# EAGLE schematic line-sensor-r2 (EAGLE 9.3.1)
Assembly variants: I2C, USART, SPI

## Sheet 1 of 4
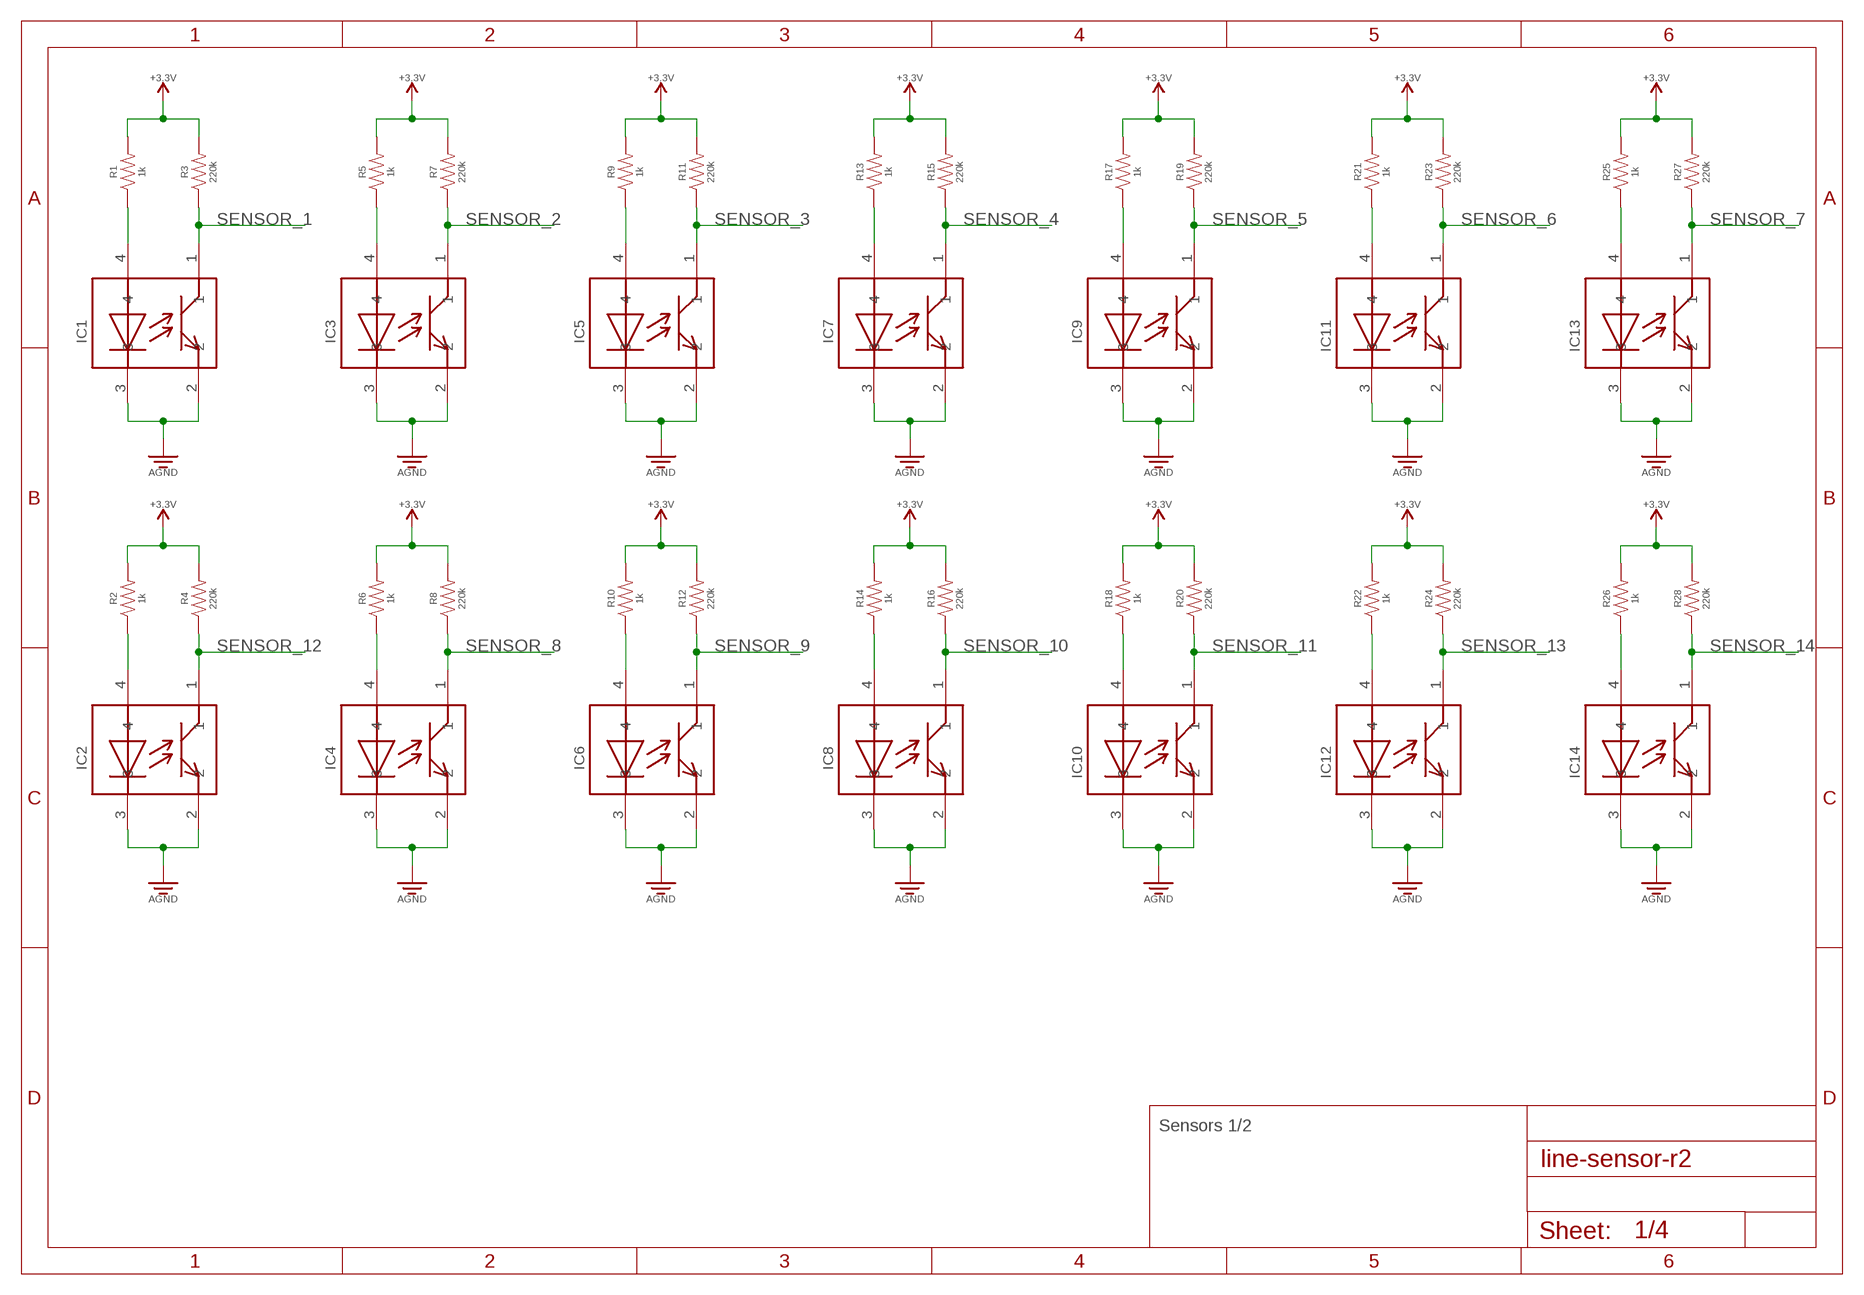
[diagram p0: schematic, sheet 1]

### Parts
IC1  GP2S60  [GP2S60]
IC2  GP2S60  [GP2S60]
IC3  GP2S60  [GP2S60]
IC4  GP2S60  [GP2S60]
IC5  GP2S60  [GP2S60]
IC6  GP2S60  [GP2S60]
IC7  GP2S60  [GP2S60]
IC8  GP2S60  [GP2S60]
IC9  GP2S60  [GP2S60]
IC10  GP2S60  [GP2S60]
IC11  GP2S60  [GP2S60]
IC12  GP2S60  [GP2S60]
IC13  GP2S60  [GP2S60]
IC14  GP2S60  [GP2S60]
R1  1k  RESISTOR_0.1W  [RESISTOR-0603]
R2  1k  RESISTOR_0.1W  [RESISTOR-0603]
R3  220k  RESISTOR_0.1W  [RESISTOR-0603]
R4  220k  RESISTOR_0.1W  [RESISTOR-0603]
R5  1k  RESISTOR_0.1W  [RESISTOR-0603]
R6  1k  RESISTOR_0.1W  [RESISTOR-0603]
R7  220k  RESISTOR_0.1W  [RESISTOR-0603]
R8  220k  RESISTOR_0.1W  [RESISTOR-0603]
R9  1k  RESISTOR_0.1W  [RESISTOR-0603]
R10  1k  RESISTOR_0.1W  [RESISTOR-0603]
R11  220k  RESISTOR_0.1W  [RESISTOR-0603]
R12  220k  RESISTOR_0.1W  [RESISTOR-0603]
R13  1k  RESISTOR_0.1W  [RESISTOR-0603]
R14  1k  RESISTOR_0.1W  [RESISTOR-0603]
R15  220k  RESISTOR_0.1W  [RESISTOR-0603]
R16  220k  RESISTOR_0.1W  [RESISTOR-0603]
R17  1k  RESISTOR_0.1W  [RESISTOR-0603]
R18  1k  RESISTOR_0.1W  [RESISTOR-0603]
R19  220k  RESISTOR_0.1W  [RESISTOR-0603]
R20  220k  RESISTOR_0.1W  [RESISTOR-0603]
R21  1k  RESISTOR_0.1W  [RESISTOR-0603]
R22  1k  RESISTOR_0.1W  [RESISTOR-0603]
R23  220k  RESISTOR_0.1W  [RESISTOR-0603]
R24  220k  RESISTOR_0.1W  [RESISTOR-0603]
R25  1k  RESISTOR_0.1W  [RESISTOR-0603]
R26  1k  RESISTOR_0.1W  [RESISTOR-0603]
R27  220k  RESISTOR_0.1W  [RESISTOR-0603]
R28  220k  RESISTOR_0.1W  [RESISTOR-0603]
SUPPLY1  +3.3V  (no package)
SUPPLY2  +3.3V  (no package)
SUPPLY3  +3.3V  (no package)
SUPPLY4  +3.3V  (no package)
SUPPLY5  +3.3V  (no package)
SUPPLY6  +3.3V  (no package)
SUPPLY7  +3.3V  (no package)
SUPPLY8  +3.3V  (no package)
SUPPLY9  +3.3V  (no package)
SUPPLY10  +3.3V  (no package)
SUPPLY11  +3.3V  (no package)
SUPPLY12  +3.3V  (no package)
SUPPLY13  +3.3V  (no package)
SUPPLY14  +3.3V  (no package)

### Nets
3V3 [3v3]: R1.P$2 R2.P$2 R3.P$2 R4.P$2 R5.P$2 R6.P$2 R7.P$2 R8.P$2 R9.P$2 R10.P$2 R11.P$2 R12.P$2 R13.P$2 R14.P$2 R15.P$2 R16.P$2 R17.P$2 R18.P$2 R19.P$2 R20.P$2 R21.P$2 R22.P$2 R23.P$2 R24.P$2 R25.P$2 R26.P$2 R27.P$2 R28.P$2 SUPPLY1.VCC SUPPLY2.VCC SUPPLY3.VCC SUPPLY4.VCC SUPPLY5.VCC SUPPLY6.VCC SUPPLY7.VCC SUPPLY8.VCC SUPPLY9.VCC SUPPLY10.VCC SUPPLY11.VCC SUPPLY12.VCC SUPPLY13.VCC SUPPLY14.VCC ; also sheet 2
GND: IC1.2 IC1.3 IC2.2 IC2.3 IC3.2 IC3.3 IC4.2 IC4.3 IC5.2 IC5.3 IC6.2 IC6.3 IC7.2 IC7.3 IC8.2 IC8.3 IC9.2 IC9.3 IC10.2 IC10.3 IC11.2 IC11.3 IC12.2 IC12.3 IC13.2 IC13.3 IC14.2 IC14.3 ; supply symbol labelled AGND ; also sheet 2,3,4
N$1: IC3.4 R5.P$1
N$2: IC1.4 R1.P$1
N$3: IC5.4 R9.P$1
N$4: IC7.4 R13.P$1
N$5: IC9.4 R17.P$1
N$6: IC11.4 R21.P$1
N$7: IC13.4 R25.P$1
N$8: IC4.4 R6.P$1
N$9: IC6.4 R10.P$1
N$10: IC8.4 R14.P$1
N$11: IC10.4 R18.P$1
N$12: IC2.4 R2.P$1
N$13: IC12.4 R22.P$1
N$14: IC14.4 R26.P$1
SENSOR_1: IC1.1 R3.P$1 ; also sheet 3
SENSOR_2: IC3.1 R7.P$1 ; also sheet 3
SENSOR_3: IC5.1 R11.P$1 ; also sheet 3
SENSOR_4: IC7.1 R15.P$1 ; also sheet 3
SENSOR_5: IC9.1 R19.P$1 ; also sheet 3
SENSOR_6: IC11.1 R23.P$1 ; also sheet 3
SENSOR_7: IC13.1 R27.P$1 ; also sheet 3
SENSOR_8: IC4.1 R8.P$1 ; also sheet 3
SENSOR_9: IC6.1 R12.P$1 ; also sheet 3
SENSOR_10: IC8.1 R16.P$1 ; also sheet 3
SENSOR_11: IC10.1 R20.P$1 ; also sheet 3
SENSOR_12: IC2.1 R4.P$1 ; also sheet 3
SENSOR_13: IC12.1 R24.P$1 ; also sheet 3
SENSOR_14: IC14.1 R28.P$1 ; also sheet 3

### Notes on the sheet
- Sensors 1/2

## Sheet 2 of 4
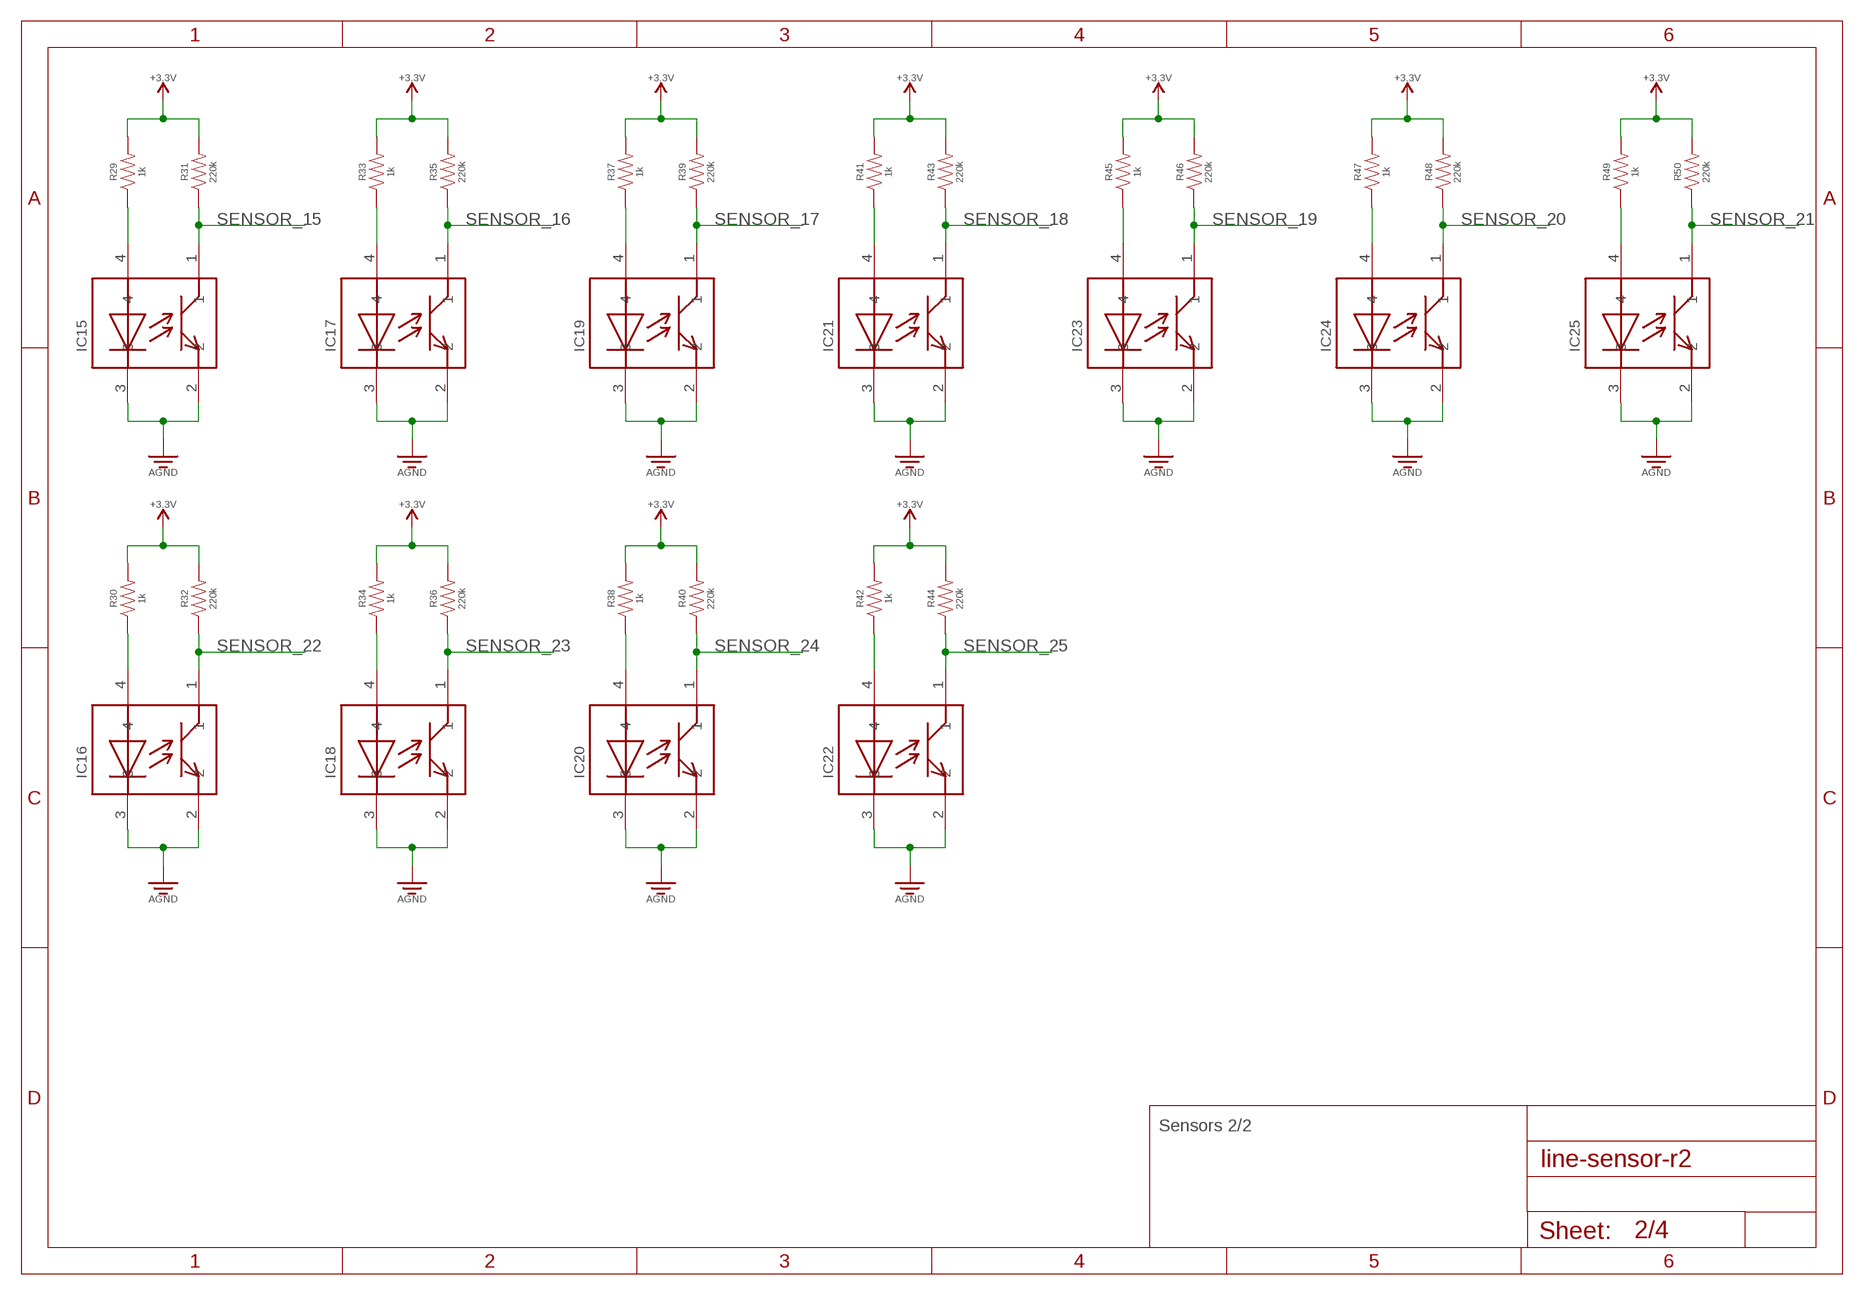
[diagram p1: schematic, sheet 2]

### Parts
IC15  GP2S60  [GP2S60]
IC16  GP2S60  [GP2S60]
IC17  GP2S60  [GP2S60]
IC18  GP2S60  [GP2S60]
IC19  GP2S60  [GP2S60]
IC20  GP2S60  [GP2S60]
IC21  GP2S60  [GP2S60]
IC22  GP2S60  [GP2S60]
IC23  GP2S60  [GP2S60]
IC24  GP2S60  [GP2S60]
IC25  GP2S60  [GP2S60]
R29  1k  RESISTOR_0.1W  [RESISTOR-0603]
R30  1k  RESISTOR_0.1W  [RESISTOR-0603]
R31  220k  RESISTOR_0.1W  [RESISTOR-0603]
R32  220k  RESISTOR_0.1W  [RESISTOR-0603]
R33  1k  RESISTOR_0.1W  [RESISTOR-0603]
R34  1k  RESISTOR_0.1W  [RESISTOR-0603]
R35  220k  RESISTOR_0.1W  [RESISTOR-0603]
R36  220k  RESISTOR_0.1W  [RESISTOR-0603]
R37  1k  RESISTOR_0.1W  [RESISTOR-0603]
R38  1k  RESISTOR_0.1W  [RESISTOR-0603]
R39  220k  RESISTOR_0.1W  [RESISTOR-0603]
R40  220k  RESISTOR_0.1W  [RESISTOR-0603]
R41  1k  RESISTOR_0.1W  [RESISTOR-0603]
R42  1k  RESISTOR_0.1W  [RESISTOR-0603]
R43  220k  RESISTOR_0.1W  [RESISTOR-0603]
R44  220k  RESISTOR_0.1W  [RESISTOR-0603]
R45  1k  RESISTOR_0.1W  [RESISTOR-0603]
R46  220k  RESISTOR_0.1W  [RESISTOR-0603]
R47  1k  RESISTOR_0.1W  [RESISTOR-0603]
R48  220k  RESISTOR_0.1W  [RESISTOR-0603]
R49  1k  RESISTOR_0.1W  [RESISTOR-0603]
R50  220k  RESISTOR_0.1W  [RESISTOR-0603]
SUPPLY15  +3.3V  (no package)
SUPPLY16  +3.3V  (no package)
SUPPLY17  +3.3V  (no package)
SUPPLY18  +3.3V  (no package)
SUPPLY19  +3.3V  (no package)
SUPPLY20  +3.3V  (no package)
SUPPLY21  +3.3V  (no package)
SUPPLY22  +3.3V  (no package)
SUPPLY23  +3.3V  (no package)
SUPPLY24  +3.3V  (no package)
SUPPLY25  +3.3V  (no package)

### Nets
3V1 [3v3]: R38.P$2 R40.P$2 SUPPLY20.VCC
3V2 [3v3]: R42.P$2 R44.P$2 SUPPLY22.VCC
3V3 [3v3]: R29.P$2 R30.P$2 R31.P$2 R32.P$2 R33.P$2 R34.P$2 R35.P$2 R36.P$2 R37.P$2 R39.P$2 R41.P$2 R43.P$2 R45.P$2 R46.P$2 R47.P$2 R48.P$2 R49.P$2 R50.P$2 SUPPLY15.VCC SUPPLY16.VCC SUPPLY17.VCC SUPPLY18.VCC SUPPLY19.VCC SUPPLY21.VCC SUPPLY23.VCC SUPPLY24.VCC SUPPLY25.VCC ; also sheet 1
GND: IC15.2 IC15.3 IC16.2 IC16.3 IC17.2 IC17.3 IC18.2 IC18.3 IC19.2 IC19.3 IC20.2 IC20.3 IC21.2 IC21.3 IC22.2 IC22.3 IC23.2 IC23.3 IC24.2 IC24.3 IC25.2 IC25.3 ; supply symbol labelled AGND ; also sheet 1,3,4
N$15: IC15.4 R29.P$1
N$16: IC17.4 R33.P$1
N$17: IC19.4 R37.P$1
N$18: IC21.4 R41.P$1
N$19: IC23.4 R45.P$1
N$20: IC24.4 R47.P$1
N$21: IC25.4 R49.P$1
N$22: IC16.4 R30.P$1
N$23: IC18.4 R34.P$1
N$24: IC20.4 R38.P$1
N$25: IC22.4 R42.P$1
SENSOR_15: IC15.1 R31.P$1 ; also sheet 3
SENSOR_16: IC17.1 R35.P$1 ; also sheet 3
SENSOR_17: IC19.1 R39.P$1 ; also sheet 3
SENSOR_18: IC21.1 R43.P$1 ; also sheet 3
SENSOR_19: IC23.1 R46.P$1 ; also sheet 3
SENSOR_20: IC24.1 R48.P$1 ; also sheet 3
SENSOR_21: IC25.1 R50.P$1 ; also sheet 3
SENSOR_22: IC16.1 R32.P$1 ; also sheet 3
SENSOR_23: IC18.1 R36.P$1 ; also sheet 3
SENSOR_24: IC20.1 R40.P$1 ; also sheet 3
SENSOR_25: IC22.1 R44.P$1 ; also sheet 3

### Notes on the sheet
- Sensors 2/2

## Sheet 3 of 4
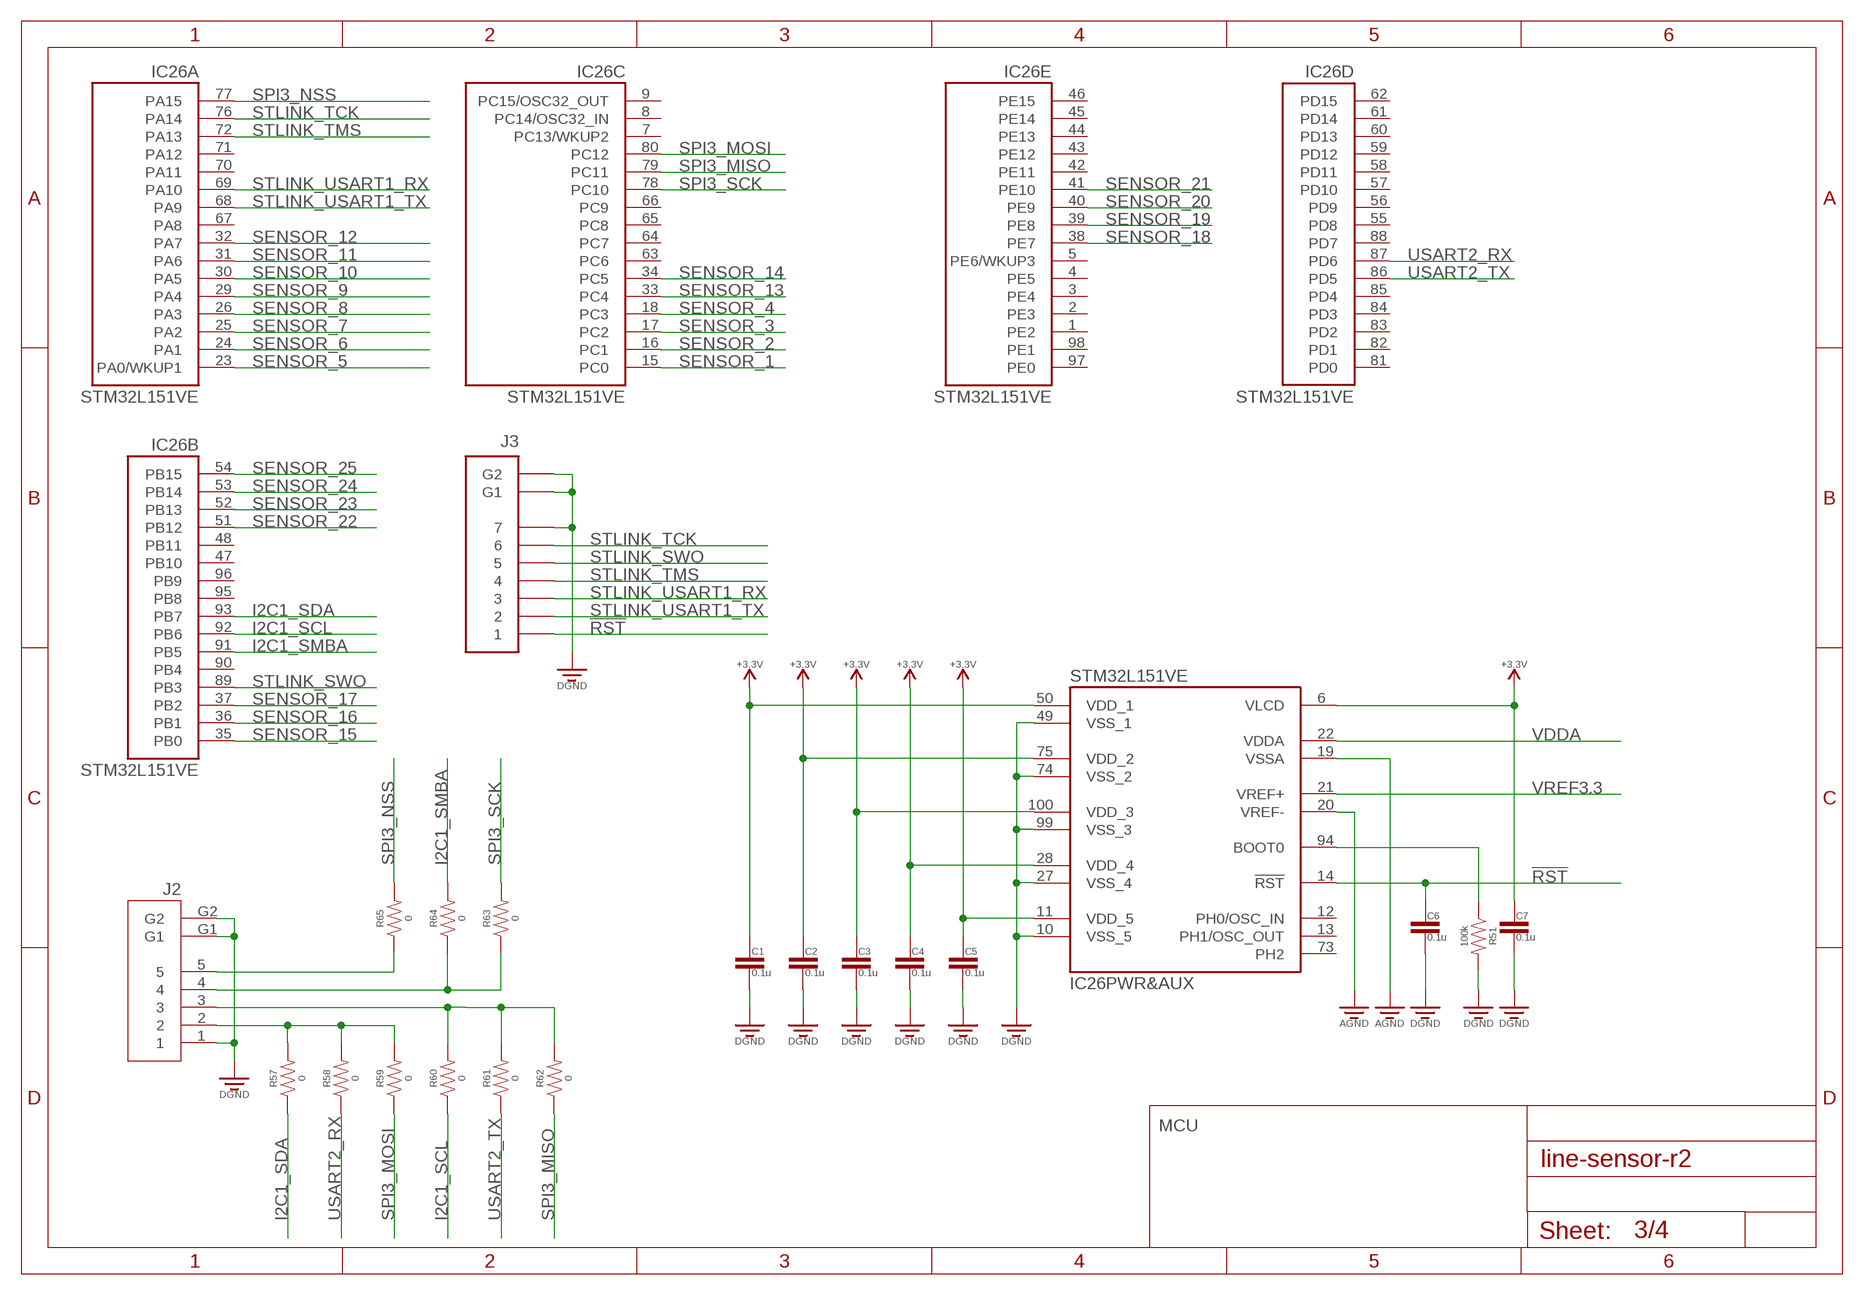
[diagram p2: schematic, sheet 3]

### Parts
C1  0.1u  CAPACITOR0603  [CAPACITOR-0603]
C2  0.1u  CAPACITOR0603  [CAPACITOR-0603]
C3  0.1u  CAPACITOR0603  [CAPACITOR-0603]
C4  0.1u  CAPACITOR0603  [CAPACITOR-0603]
C5  0.1u  CAPACITOR0603  [CAPACITOR-0603]
C6  0.1u  CAPACITOR0603  [CAPACITOR-0603]
C7  0.1u  CAPACITOR0603  [CAPACITOR-0603]
IC26  STM32L151VE  [LQFP100_14X14]
J2  MOLEX-502382-05XX  [MOLEX-502382-05XX]
J3  MOLEX-53261-0771  [MOLEX-53261-0771]
R51  100k  RESISTOR_0.1W  [RESISTOR-0603]
R57  0  RESISTOR_0.1W  [RESISTOR-0603]  (not fitted in variant USART)  (not fitted in variant SPI)
R58  0  RESISTOR_0.1W  [RESISTOR-0603]  (not fitted in variant I2C)  (not fitted in variant SPI)
R59  0  RESISTOR_0.1W  [RESISTOR-0603]  (not fitted in variant I2C)  (not fitted in variant USART)
R60  0  RESISTOR_0.1W  [RESISTOR-0603]  (not fitted in variant USART)  (not fitted in variant SPI)
R61  0  RESISTOR_0.1W  [RESISTOR-0603]  (not fitted in variant I2C)  (not fitted in variant SPI)
R62  0  RESISTOR_0.1W  [RESISTOR-0603]  (not fitted in variant I2C)  (not fitted in variant USART)
R63  0  RESISTOR_0.1W  [RESISTOR-0603]  (not fitted in variant I2C)  (not fitted in variant USART)
R64  0  RESISTOR_0.1W  [RESISTOR-0603]  (not fitted in variant USART)  (not fitted in variant SPI)
R65  0  RESISTOR_0.1W  [RESISTOR-0603]  (not fitted in variant I2C)  (not fitted in variant USART)
SUPPLY26  +3.3V  (no package)
SUPPLY27  +3.3V  (no package)
SUPPLY28  +3.3V  (no package)
SUPPLY29  +3.3V  (no package)
SUPPLY30  +3.3V  (no package)
SUPPLY31  +3.3V  (no package)

### Nets
!RST: C6.1 IC26.14(PWR&AUX:!RST!) J3.1
BOOT0: IC26.94(PWR&AUX:BOOT0) R51.P$1
GND: C1.2 C2.2 C3.2 C4.2 C5.2 C6.2 C7.2 IC26.10(PWR&AUX:VSS_5) IC26.19(PWR&AUX:VSSA) IC26.20(PWR&AUX:VREF-) IC26.27(PWR&AUX:VSS_4) IC26.49(PWR&AUX:VSS_1) IC26.74(PWR&AUX:VSS_2) IC26.99(PWR&AUX:VSS_3) J2.1 J2.G1 J2.G2 J3.7 J3.G1 J3.G2 R51.P$2 ; supply symbol labelled DGND, AGND ; also sheet 1,2,4
I2C1_SCL: IC26.92(B:PB6) R60.P$1
I2C1_SDA: IC26.93(B:PB7) R57.P$1
I2C1_SMBA: IC26.91(B:PB5) R64.P$2
N$26: J2.2 R57.P$2 R58.P$2 R59.P$2
N$27: J2.3 R60.P$2 R61.P$2 R62.P$2
N$28: J2.4 R63.P$1 R64.P$1
N$29: J2.5 R65.P$1
SENSOR_1: IC26.15(C:PC0) ; also sheet 1
SENSOR_2: IC26.16(C:PC1) ; also sheet 1
SENSOR_3: IC26.17(C:PC2) ; also sheet 1
SENSOR_4: IC26.18(C:PC3) ; also sheet 1
SENSOR_5: IC26.23(A:PA0/WKUP1) ; also sheet 1
SENSOR_6: IC26.24(A:PA1) ; also sheet 1
SENSOR_7: IC26.25(A:PA2) ; also sheet 1
SENSOR_8: IC26.26(A:PA3) ; also sheet 1
SENSOR_9: IC26.29(A:PA4) ; also sheet 1
SENSOR_10: IC26.30(A:PA5) ; also sheet 1
SENSOR_11: IC26.31(A:PA6) ; also sheet 1
SENSOR_12: IC26.32(A:PA7) ; also sheet 1
SENSOR_13: IC26.33(C:PC4) ; also sheet 1
SENSOR_14: IC26.34(C:PC5) ; also sheet 1
SENSOR_15: IC26.35(B:PB0) ; also sheet 2
SENSOR_16: IC26.36(B:PB1) ; also sheet 2
SENSOR_17: IC26.37(B:PB2) ; also sheet 2
SENSOR_18: IC26.38(E:PE7) ; also sheet 2
SENSOR_19: IC26.39(E:PE8) ; also sheet 2
SENSOR_20: IC26.40(E:PE9) ; also sheet 2
SENSOR_21: IC26.41(E:PE10) ; also sheet 2
SENSOR_22: IC26.51(B:PB12) ; also sheet 2
SENSOR_23: IC26.52(B:PB13) ; also sheet 2
SENSOR_24: IC26.53(B:PB14) ; also sheet 2
SENSOR_25: IC26.54(B:PB15) ; also sheet 2
SPI3_MISO: IC26.79(C:PC11) R62.P$1
SPI3_MOSI: IC26.80(C:PC12) R59.P$1
SPI3_NSS: IC26.77(A:PA15) R65.P$2
SPI3_SCK: IC26.78(C:PC10) R63.P$2
STLINK_SWO: IC26.89(B:PB3) J3.5
STLINK_TCK: IC26.76(A:PA14) J3.6
STLINK_TMS: IC26.72(A:PA13) J3.4
STLINK_USART1_RX: IC26.69(A:PA10) J3.3
STLINK_USART1_TX: IC26.68(A:PA9) J3.2
USART2_RX: IC26.87(D:PD6) R58.P$1
USART2_TX: IC26.86(D:PD5) R61.P$1
VDD: C1.1 C2.1 C3.1 C4.1 C5.1 C7.1 IC26.6(PWR&AUX:VLCD) IC26.11(PWR&AUX:VDD_5) IC26.28(PWR&AUX:VDD_4) IC26.50(PWR&AUX:VDD_1) IC26.75(PWR&AUX:VDD_2) IC26.100(PWR&AUX:VDD_3) SUPPLY26.VCC SUPPLY27.VCC SUPPLY28.VCC SUPPLY29.VCC SUPPLY30.VCC SUPPLY31.VCC ; also sheet 4
VDDA: IC26.22(PWR&AUX:VDDA) ; also sheet 4
VREF3.3: IC26.21(PWR&AUX:VREF+) ; also sheet 4
Unconnected: IC26.1(E:PE2) IC26.2(E:PE3) IC26.3(E:PE4) IC26.4(E:PE5) IC26.5(E:PE6/WKUP3) IC26.7(C:PC13/WKUP2) IC26.8(C:PC14/OSC32_IN) IC26.9(C:PC15/OSC32_OUT) IC26.12(PWR&AUX:PH0/OSC_IN) IC26.13(PWR&AUX:PH1/OSC_OUT) IC26.42(E:PE11) IC26.43(E:PE12) IC26.44(E:PE13) IC26.45(E:PE14) IC26.46(E:PE15) IC26.47(B:PB10) IC26.48(B:PB11) IC26.55(D:PD8) IC26.56(D:PD9) IC26.57(D:PD10) IC26.58(D:PD11) IC26.59(D:PD12) IC26.60(D:PD13) IC26.61(D:PD14) IC26.62(D:PD15) IC26.63(C:PC6) IC26.64(C:PC7) IC26.65(C:PC8) IC26.66(C:PC9) IC26.67(A:PA8) IC26.70(A:PA11) IC26.71(A:PA12) IC26.73(PWR&AUX:PH2) IC26.81(D:PD0) IC26.82(D:PD1) IC26.83(D:PD2) IC26.84(D:PD3) IC26.85(D:PD4) IC26.88(D:PD7) IC26.90(B:PB4) IC26.95(B:PB8) IC26.96(B:PB9) IC26.97(E:PE0) IC26.98(E:PE1)

### Notes on the sheet
- MCU

## Sheet 4 of 4
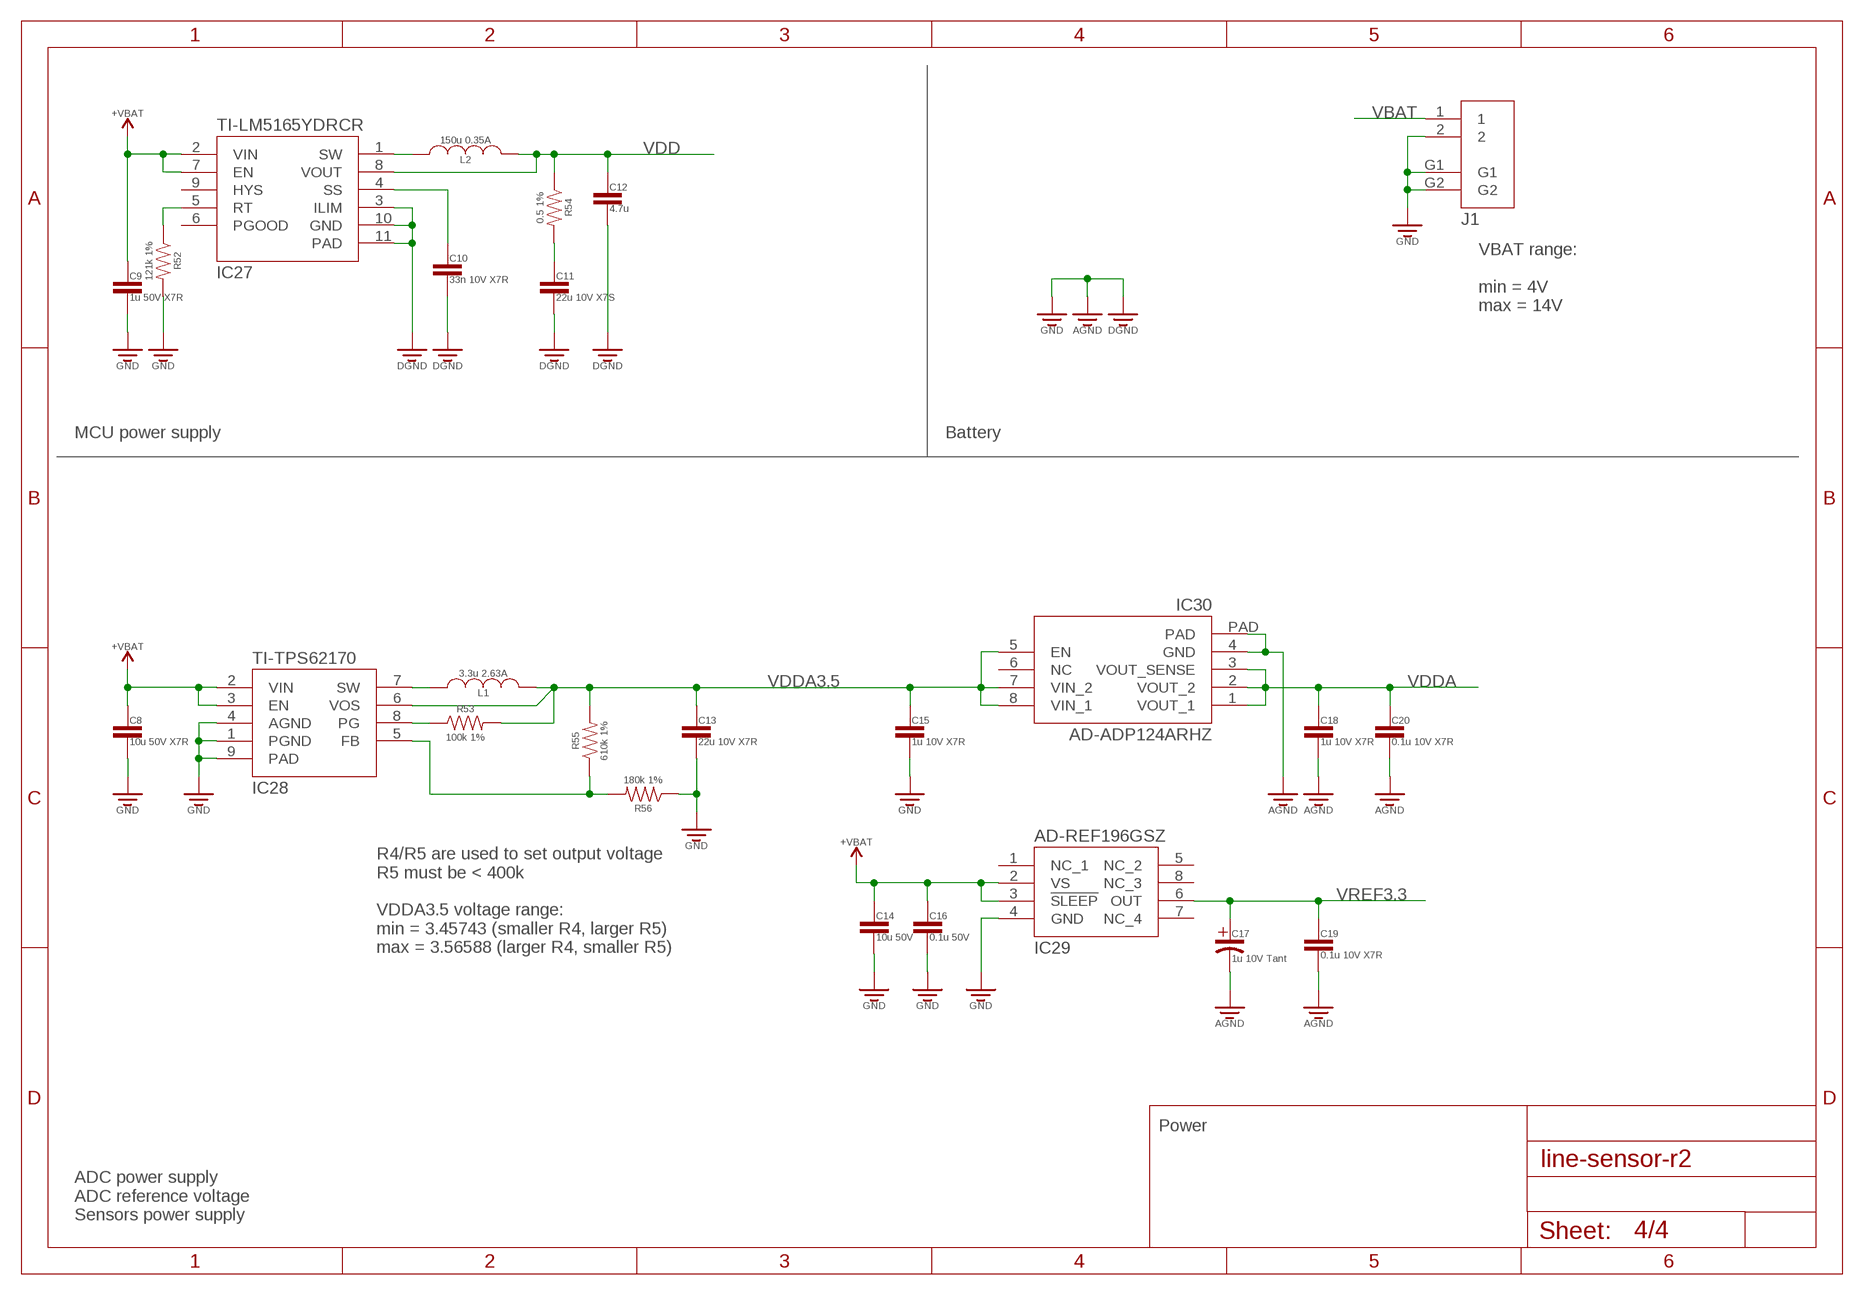
[diagram p3: schematic, sheet 4]

### Parts
C8  10u 50V X7R  CAPACITOR0805  [CAPACITOR-0805]
C9  1u 50V X7R  CAPACITOR1206  [CAPACITOR-1206]
C10  33n 10V X7R  CAPACITOR0603  [CAPACITOR-0603]
C11  22u 10V X7S  CAPACITOR0805  [CAPACITOR-0805]
C12  4.7u  CAPACITOR0805  [CAPACITOR-0805]
C13  22u 10V X7R  CAPACITOR0805  [CAPACITOR-0805]
C14  10u 50V  CAPACITOR0603  [CAPACITOR-0603]
C15  1u 10V X7R  CAPACITOR0805  [CAPACITOR-0805]
C16  0.1u 50V  CAPACITOR0603  [CAPACITOR-0603]
C17  1u 10V Tant  CAPACITOR_POLARIZED  [CAPACITOR_POLARIZED-1411-(3528-MET)]
C18  1u 10V X7R  CAPACITOR0805  [CAPACITOR-0805]
C19  0.1u 10V X7R  CAPACITOR0603  [CAPACITOR-0603]
C20  0.1u 10V X7R  CAPACITOR0603  [CAPACITOR-0603]
IC27  TI-LM5165YDRCR  [VSON-10-0.5MM]
IC28  TI-TPS62170  [WSON-8-0.5MM]
IC29  AD-REF196GSZ  [SOIC-8]
IC30  AD-ADP124ARHZ  [MSOP-8-EP]
J1  MOLEX-502382-02XX  [MOLEX-502382-02XX]
L1  3.3u 2.63A  VLS3012HBX  [VLS3012HBX]
L2  150u 0.35A  ELL-6SH151M  [ELL-6SH151M]
R52  121k 1%  RESISTOR_0.1W  [RESISTOR-0603]
R53  100k 1%  RESISTOR_0.1W  [RESISTOR-0603]
R54  0.5 1%  RESISTOR_0.1W  [RESISTOR-0603]
R55  610k 1%  RESISTOR_0.1W  [RESISTOR-0603]
R56  180k 1%  RESISTOR_0.1W  [RESISTOR-0603]
SUPPLY32  +VBAT  (no package)
SUPPLY33  +VBAT  (no package)
SUPPLY34  +VBAT  (no package)

### Nets
GND: C8.2 C9.P$2 C10.2 C11.2 C12.2 C13.2 C14.2 C15.2 C16.2 C17.NEG C18.2 C19.2 C20.2 IC27.3(ILIM) IC27.10(GND) IC27.11(PAD) IC28.1(PGND) IC28.4(AGND) IC28.9(PAD) IC29.4(GND) IC30.4(GND) IC30.PAD J1.2 J1.G1 J1.G2 R52.P$2 R56.P$1 ; supply symbol labelled DGND, AGND ; also sheet 1,2,3
IC27_SW: IC27.1(SW) L2.1
IC28_SW: IC28.7(SW) L1.1
N$33: IC27.5(RT) R52.P$1
N$34: C10.1 IC27.4(SS)
N$36: C11.1 R54.P$2
N$38: IC28.8(PG) R53.P$1
N$39: IC28.5(FB) R55.P$1 R56.P$2
VBAT: C8.1 C9.P$1 C14.1 C16.1 IC27.2(VIN) IC27.7(EN) IC28.2(VIN) IC28.3(EN) IC29.2(VS) IC29.3(!SLEEP) J1.1 SUPPLY32.VCC SUPPLY33.VCC SUPPLY34.VCC
VDD: C12.1 IC27.8(VOUT) L2.2 R54.P$1 ; also sheet 3
VDDA: C18.1 C20.1 IC30.1(VOUT_1) IC30.2(VOUT_2) IC30.3(VOUT_SENSE) ; also sheet 3
VDDA3.5: C13.1 C15.1 IC28.6(VOS) IC30.5(EN) IC30.7(VIN_2) IC30.8(VIN_1) L1.2 R53.P$2 R55.P$2
VREF3.3: C17.POS C19.1 IC29.6(OUT) ; also sheet 3
Unconnected: IC27.6(PGOOD) IC27.9(HYS) IC29.1(NC_1) IC29.5(NC_2) IC29.7(NC_4) IC29.8(NC_3) IC30.6(NC)

### Notes on the sheet
- VBAT range:
  
  min = 4V
  max = 14V
- MCU power supply | Battery
- R4/R5 are used to set output voltage
  R5 must be < 400k
  
  VDDA3.5 voltage range:
  min = 3.45743 (smaller R4, larger R5)
  max = 3.56588 (larger R4, smaller R5)
- Power
- ADC power supply
  ADC reference voltage
  Sensors power supply

## Library data of the parts
C1-C16 C18-C20 = capacitors:CAPACITOR
C17 = capacitors:CAPACITOR_POLARIZED
IC1-IC25 = sensors:GP2S60: SMT Compact Reﬂective Photointerrupter Datasheet: http://www.sharp-world.com/products/device/lineup/data/pdf/datasheet/gp2s60_e.pdf
IC26 = mcu:STM32L151VE
IC27 = voltage-source:TI-LM5165YDRCR
IC28 = voltage-source:TI-TPS62170
IC29 = voltage-source:AD-REF196GSZ
IC30 = voltage-source:AD-ADP124ARHZ
J1 = connectors:MOLEX-502382-02XX
J2 = connectors:MOLEX-502382-05XX
J3 = connectors:MOLEX-53261-0771
L1 = inductors:VLS3012HBX
L2 = inductors:ELL-6SH151M
R1-R65 = resistors:RESISTOR_0.1W
SUPPLY1-SUPPLY31 = voltage-ground:+3.3V: +3.3V Voltage Supply Positive voltage supply (traditionally for a BJT device, C=collector).
SUPPLY32-SUPPLY34 = voltage-ground:+VBAT: +3.3V Voltage Supply Positive voltage supply (traditionally for a BJT device, C=collector).

## Net classes
1 ground: width 0.3 mm
2 3v3: width 0.3 mm